# EAGLE design 2Rotary (EAGLE 8.7.0)
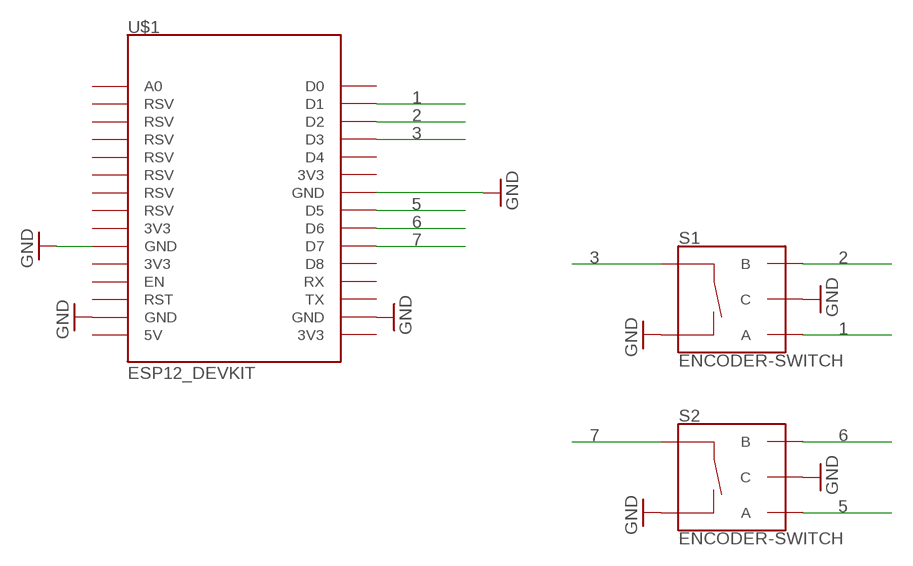
[diagram p0: schematic, sheet 1]

## Parts
S1  ENCODER-SWITCH  [ROTARY_ENC_PLAIN]
S2  ENCODER-SWITCH  [ROTARY_ENC_PLAIN]
U$1  ESP12_DEVKIT  [ESP12_DEVKIT]

## Nets
1: S1.A U$1.D1
2: S1.B U$1.D2
3: S1.SW+ U$1.D3
5: S2.A U$1.D5
6: S2.B U$1.D6
7: S2.SW+ U$1.D7
GND: S1.C S1.SW- S2.C S2.SW- U$1.GND@0(GND) U$1.GND@1(GND) U$1.GND@2(GND) U$1.GND@3(GND)
Unconnected: U$1.3V3@0(3V3) U$1.3V3@1(3V3) U$1.3V3@2(3V3) U$1.3V3@3(3V3) U$1.5V U$1.A0 U$1.D0 U$1.D4 U$1.D8 U$1.EN U$1.GND@4(RSV) U$1.RST U$1.RSV@0(RSV) U$1.RSV@1(RSV) U$1.RSV@2(RSV) U$1.RSV@3(RSV) U$1.RSV@4(RSV) U$1.RSV@5(RSV) U$1.RX U$1.TX

## Library data of the parts
S1 S2 = SparkFun-Switches:ENCODER-SWITCH: Rotary Encoder w/ Select Switch Encoders rotate similarly to potentiometers, but they’re different from potentiometers in that an encoder has full rotation without limits. They output gray code so that you can tell how much and in which direction the encoder has been turned. This encoder includes a push-down select switch built into the shaft. SparkFun Products Rotary Encoder <https://www.sparkfun.com/products/9117> (COM-09117); SF_SKU: COM-09117
U$1 = ESP12_DEVKIT:ESP12_DEVKIT: ESP12 DEVKIT BOARD

## Board
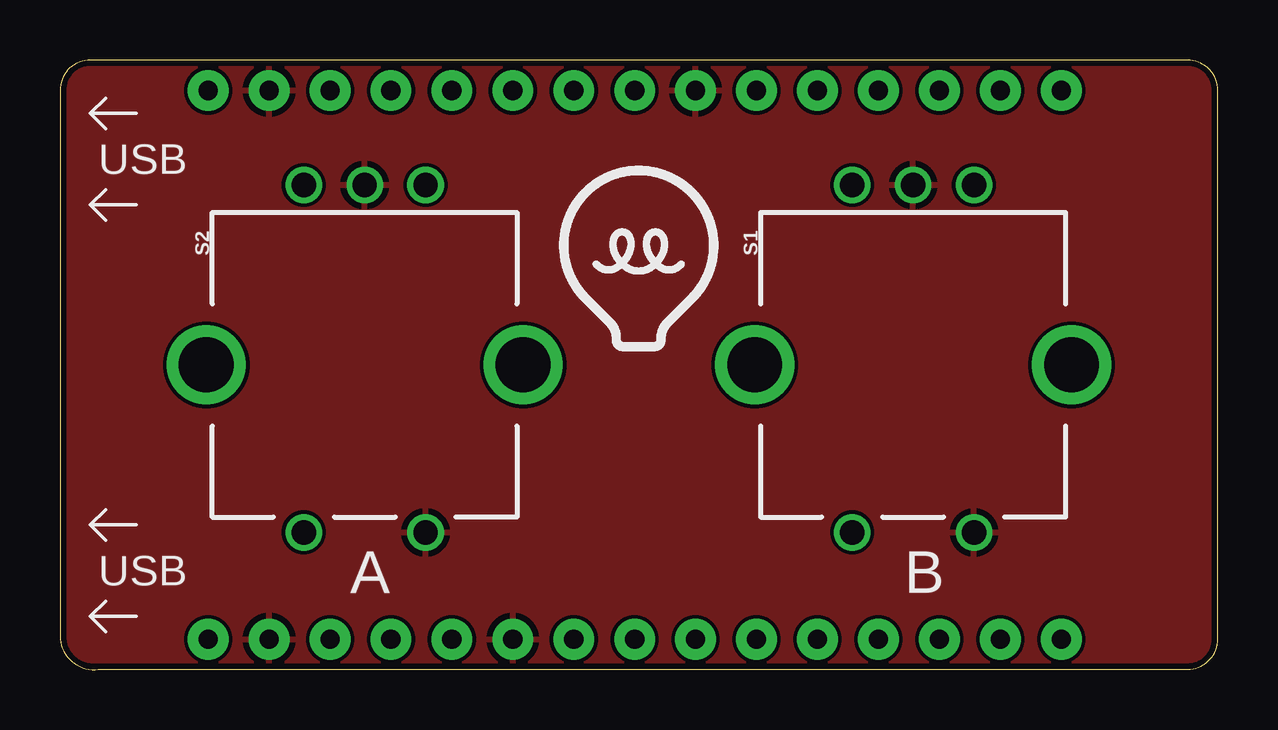
[diagram p1: board, top side]
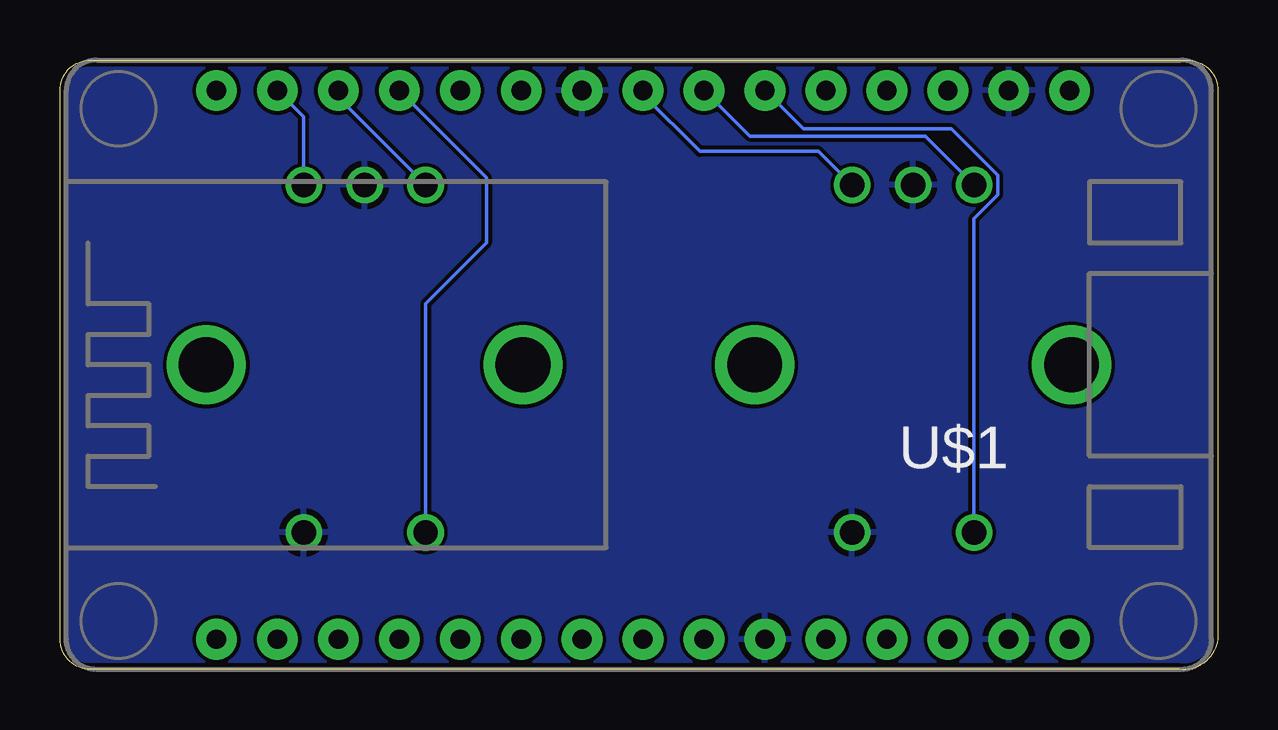
[diagram p2: board, bottom side, seen from below]

Size 48.26 x 25.4 mm. Coordinates in mm from the lower left corner, seen from the top.
Outline: 46.99,25.4 1.27,25.4 arc90 0,24.13 0,1.27 arc90 1.6,0.01 47,0.01 arc90 48.26,1.27 48.26,24.13 arc90 46.99,25.4
Copper layers (1*16): Top 0.035mm / dielectric 1.5mm / Bottom 0.035mm
Design rules "SeeedStudio_2layer_DRU_no_angle_20140221": minimum track width 6mil, minimum drill 12mil, track to track 6mil, track to pad 6mil, pad to pad 6mil, via to via 6mil, smd to smd 0mil, copper to edge 10mil, drill to drill 10mil, minimum pad ring 10mil, minimum via ring 6mil, stop-mask expansion 2mil, vias tented up to drill 100mil, thermal gap 10mil

### Footprints (pad centres in the part's own frame; a part is rotated, then mirrored left to right if it is on the bottom)
ROTARY_ENC_PLAIN = drill 1.016: A 7.493,-2.54; B 7.493,2.54; C 7.493,0; SW+ -6.985,2.54; SW- -6.985,-2.54 | drill 2.286: P$3 0,6.604; P$4 0,-6.604
ESP12_DEVKIT = drill 0.8 pad 1.7: 3V3@0 -11.43,-7.795; 3V3@1 11.43,4.905; 3V3@2 11.43,-17.955; 3V3@3 -11.43,-2.715; 5V -11.43,-17.955; A0 -11.43,17.605; D0 11.43,17.605; D1 11.43,15.065; D2 11.43,12.525; D3 11.43,9.985; D4 11.43,7.445; D5 11.43,-0.175; D6 11.43,-2.715; D7 11.43,-5.255; D8 11.43,-7.795; EN -11.43,-10.335; GND@0 -11.43,-5.255; GND@1 -11.43,-15.415; GND@2 11.43,2.365; GND@3 11.43,-15.415; GND@4 -11.43,-0.175; RST -11.43,-12.875; RSV@0 -11.43,15.065; RSV@1 -11.43,12.525; RSV@2 -11.43,9.985; RSV@3 -11.43,7.445; RSV@4 -11.43,4.905; RSV@5 -11.43,2.365; RX 11.43,-10.335; TX 11.43,-12.875

### Placement (x,y rotation side)
S1  35.56,12.7 90 top
S2  12.7,12.7 90 top
U$1  24.13,12.7 90 bottom
U$2  [HEEPLOGOSMALL]  24.13,17.27 0 top

### Tracks (layer width: path | path; a pad name or v marks a point on that pad's centre or on a via)
1
  Bottom 0.152: S1.A 38.1,23.03 U$1.D1
2
  Bottom 0.152: U$1.D2 36.66,23.83 S1.B
3
  Bottom 0.152: U$1.D3 30.48,20.49 30.48,17.78 33.02,15.24 S1.SW+
5
  Bottom 0.152: S2.A 16.64,21.59 21.59,21.59 23.96,23.95 U$1.D5
6
  Bottom 0.152: U$1.D6 19.51,22.22 12.19,22.22 S2.B
7
  Bottom 0.152: U$1.D7 17.28,22.53 11.1,22.53 9.17,20.6 9.17,19.78 10.16,18.79 S2.SW+
GND
  pour Top: -2.54,26.67 49.53,26.67 49.53,-2.54 -2.54,-2.54
  pour Bottom: -5.4,30.8 53.97,30.8 53.97,-6.67 -5.4,-6.67

### Text on the board
tPlace: USB | USB | A | B